# EAGLE design bpod_stepper_1.2 (EAGLE 9.6.2)
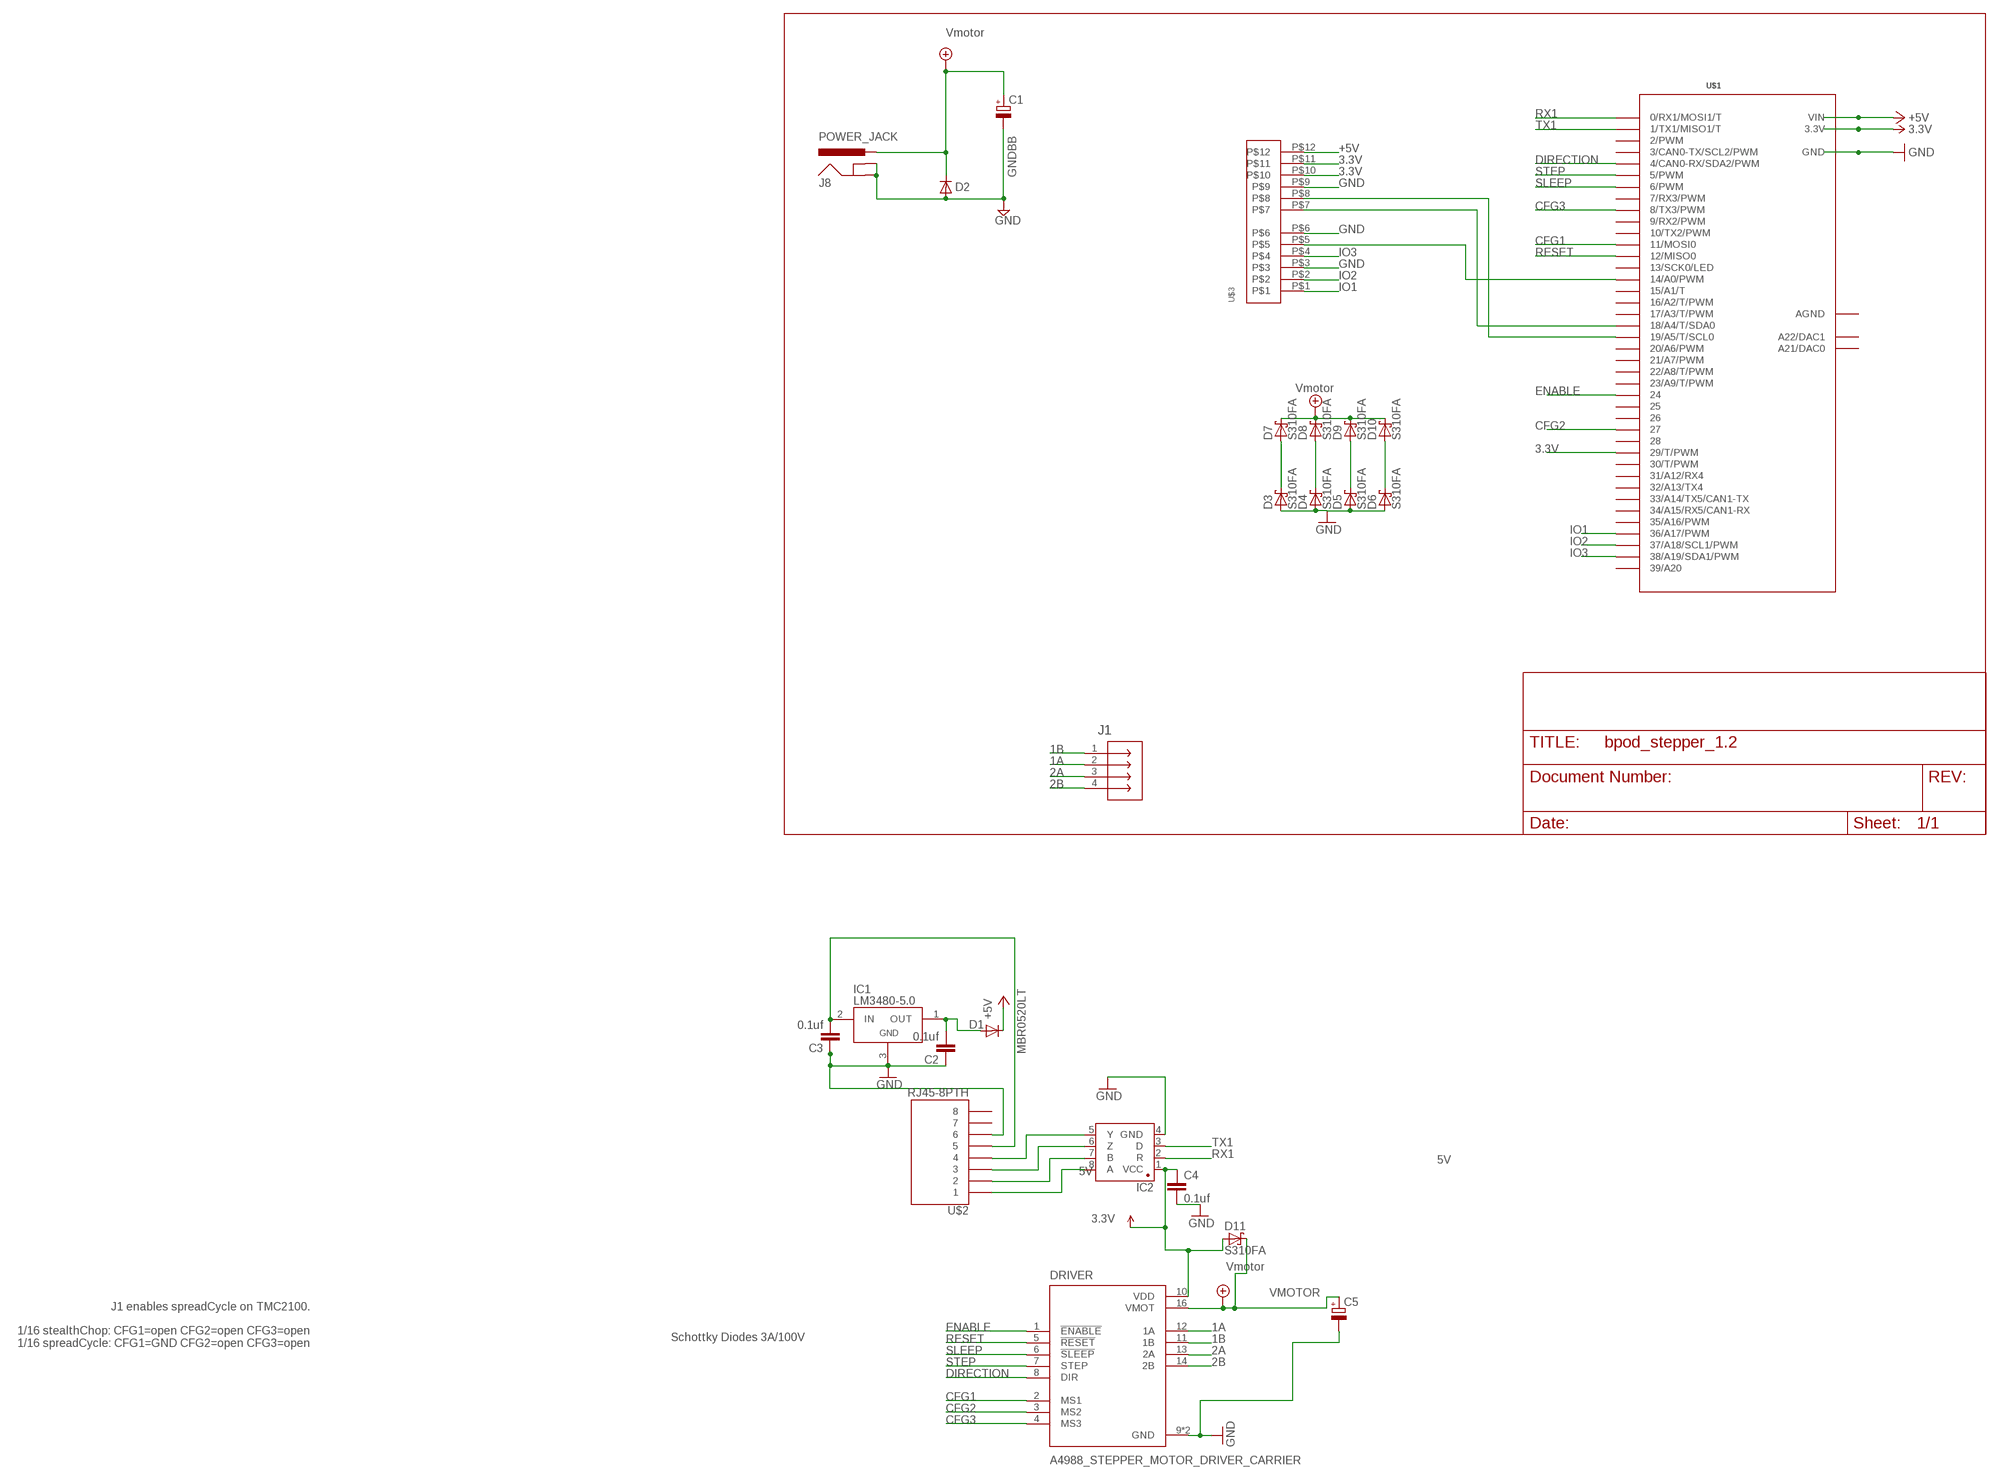
[diagram p0: schematic, sheet 1]

## Parts
C1  CPOL-EUG  [PANASONIC_G]
C2  0.1uf  CAP1206  [1206@1]
C3  0.1uf  CAP1206  [1206@1]
C4  0.1uf  CAP1206  [1206@1]
C5  CPOL-EUG  [PANASONIC_G]
D1  MBR0520LT  [SOD123]
D2  DIODE-DO214AA  [DO214AA]
D3  S310FA  D_SCHOTTKY-SOD123  [SOD123]
D4  S310FA  D_SCHOTTKY-SOD123  [SOD123]
D5  S310FA  D_SCHOTTKY-SOD123  [SOD123]
D6  S310FA  D_SCHOTTKY-SOD123  [SOD123]
D7  S310FA  D_SCHOTTKY-SOD123  [SOD123]
D8  S310FA  D_SCHOTTKY-SOD123  [SOD123]
D9  S310FA  D_SCHOTTKY-SOD123  [SOD123]
D10  S310FA  D_SCHOTTKY-SOD123  [SOD123]
D11  S310FA  D_SCHOTTKY-SOD123  [SOD123]
DRIVER  A4988_STEPPER_MOTOR_DRIVER_CARRIER  [MODULE_A4988_STEPPER_MOTOR_DRIVER_CARRIER]
IC1  LM3480-5.0  [SOT-23-3]
IC2  SN65HVD31DR  [SO08]
J1  282841-4  [CONN4_282841-4_TEC]
J8  POWER_JACK  [POWER_JACK_PTH]
U$1  TEENSY_3.6_DIL  [TEENSY_3.6_DIL]
U$2  RJ45-8PTH  [RJ45-8]
U$3  12POS_MOLEX_SOCKET  [12POS_MOLEX_SOCKET]

## Nets
1A: D4.C D8.A DRIVER.12(1A) J1.2
1B: D3.C D7.A DRIVER.11(1B) J1.1
2A: D5.C D9.A DRIVER.13(2A) J1.3
2B: D6.C D10.A DRIVER.14(2B) J1.4
3.3V: C4.1 D11.A DRIVER.10(VDD) IC2.1(VCC) U$1.3.3V U$1.3.3V3(3.3V) U$1.29(29/T/PWM) U$3.P$10 U$3.P$11
+5V: D1.C U$1.VIN U$3.P$12
CFG1: DRIVER.2(MS1) U$1.11(11/MOSI0)
CFG2: DRIVER.3(MS2) U$1.27
CFG3: DRIVER.4(MS3) U$1.8(8/TX3/PWM)
DIRECTION: DRIVER.8(DIR) U$1.4(4/CAN0-RX/SDA2/PWM)
ENABLE: DRIVER.1(!ENABLE) U$1.24
GND: C1.- C2.1 C3.1 C4.2 C5.- D2.A D3.A D4.A D5.A D6.A DRIVER.9(GND) DRIVER.15(GND) IC1.3(GND) IC2.4(GND) J8.GND J8.GNDBREAK U$1.GND U$1.GND1(GND) U$2.6 U$3.P$3 U$3.P$6 U$3.P$9
IO1: U$1.36/A17(36/A17/PWM) U$3.P$1
IO2: U$1.37/A18(37/A18/SCL1/PWM) U$3.P$2
IO3: U$1.38/A19(38/A19/SDA1/PWM) U$3.P$4
N$1: U$1.19/A5(19/A5/T/SCL0) U$3.P$8
N$2: U$1.18/A4(18/A4/T/SDA0) U$3.P$7
N$3: U$1.14/A0(14/A0/PWM) U$3.P$5
N$7: IC2.8(A) U$2.1
N$8: IC2.7(B) U$2.2
N$9: IC2.6(Z) U$2.3
N$10: IC2.5(Y) U$2.4
N$14: C2.2 D1.A IC1.1(OUT)
N$24: C3.2 IC1.2(IN) U$2.5
RESET: DRIVER.5(!RESET) U$1.12(12/MISO0)
RX1: IC2.2(R) U$1.0(0/RX1/MOSI1/T)
SLEEP: DRIVER.6(!SLEEP) U$1.6(6/PWM)
STEP: DRIVER.7(STEP) U$1.5(5/PWM)
TX1: IC2.3(D) U$1.1(1/TX1/MISO1/T)
VMOTOR: C1.+ C5.+ D2.C D7.C D8.C D9.C D10.C D11.C DRIVER.16(VMOT) J8.PWR ; supply symbol labelled Vmotor
Unconnected: U$1.2(2/PWM) U$1.3(3/CAN0-TX/SCL2/PWM) U$1.7(7/RX3/PWM) U$1.9(9/RX2/PWM) U$1.10(10/TX2/PWM) U$1.13(13/SCK0/LED) U$1.15/A1(15/A1/T) U$1.16/A2(16/A2/T/PWM) U$1.17/A3(17/A3/T/PWM) U$1.20/A6(20/A6/PWM) U$1.21/A7(21/A7/PWM) U$1.22/A8(22/A8/T/PWM) U$1.23/A9(23/A9/T/PWM) U$1.25 U$1.26 U$1.28 U$1.30(30/T/PWM) U$1.31/A12(31/A12/RX4) U$1.32/A13(32/A13/TX4) U$1.33/A14(33/A14/TX5/CAN1-TX) U$1.34/A15(34/A15/RX5/CAN1-RX) U$1.35/A16(35/A16/PWM) U$1.39/A20 U$1.A21(A21/DAC0) U$1.A22(A22/DAC1) U$2.7 U$2.8

## Notes on the sheet
- GNDBB
- 5V
- 5V
- J1 enables spreadCycle on TMC2100.
  
  1/16 stealthChop: CFG1=open CFG2=open CFG3=open
  1/16 spreadCycle: CFG1=GND CFG2=open CFG3=open
- Schottky Diodes 3A/100V

## Power pins joined to a net without a drawn wire
AGND: U$1.AGND

## Library data of the parts
C1 C5 = rcl:CPOL-EU: POLARIZED CAPACITOR, European symbol; SPICEPREFIX: C
C2-C4 = SparkFun-Capacitors:CAP: Capacitor Standard 0603 ceramic capacitor, and 0.1" leaded capacitor.
D1 = diode:MBR0520LT: SCHOTTKY BARRIER RECTIFIER Source: http://onsemi.com .. MBR0520LT1-D.pdf
D2 = diode:DIODE-: DIODE
D3-D11 = we-rcl:D_SCHOTTKY: Schottky Diodes 1A, 30V - SOD323 (BAS3010 or CUS10S40) 2A, 30V - SMA/DO214AC 10A,45V - Z5-T (CDBZ5T1045)
DRIVER = A4988_STEPPER_MOTOR_DRIVER_CARRIER:A4988_STEPPER_MOTOR_DRIVER_CARRIER: Stepper motor controler; IC: A4988; 1A; Uin mot: 8÷35V; AVAILABILITY: Unavailable; DESCRIPTION: Stepper Motor Driver; MF: Pololu; MP: A4988 STEPPER MOTOR DRIVER CARRIER; PACKAGE: None; PRICE: None
IC1 = regulators:LM3480-*: National Semiconductor LM3480 100 mA, SOT-23, quasi-LDO linear regulator
IC2 = Joshparts4:SN65HVD31DR: A placeholder for generic narrow & wide SOIC8 foorptints - used on the DIP adapter board.
J1 = TERMI-BLOK PCB MOUNT 4P. 5:282841-4; BUILT_BY: SunStream; COPYRIGHT: Copyright (C) 2018 Accelerated Designs. All rights reserved; DATASHEET: https://www.te.com/commerce/DocumentDelivery/DDEController?Action=showdoc&DocId=Customer+Drawing%7F282841%7FH6%7Fpdf%7FEnglish%7FENG_CD_282841_H6.pdf%7F282841-4; DESCRIPTION: TERMINAL BLOCK, PCB MOUNT, W/INTERLOCK, 5.08MM PITCH; MANUFACTURER_PART_NUMBER: 282841-4; SOURCELIBRARY: TE_Connectivity_600_Part_Delivery_14_2020-03-09; VENDOR: TE Connectivity
J8 = SparkFun-Connectors:POWER_JACK: Power Jack Connector This is the standard 5.5mm barrel jack for power. The PTH is the most common, proven, reliable, footprint. The Slot footprint only works if the mill layer is transmitted to the PCB fab house so be warned. Here are the connectors we sell at SparkFun: DC Barrel Power Jack/Connector <https://www.sparkfun.com/products/119> (PRT-00119) DC Barrel Power Jack/Connector (SMD) <https://www.sparkfun.com/products/12748> (PRT-12748) DC Barrel Jack Adapter - Breadboard Compatible <https://www.sparkfun.com/products/10811> (PRT-10811) It is used on this SparkFun product (and many, many others): SparkFun RedBoard - Programmed with Arduino <https://www.sparkfun.com/products/12757> (DEV-12757) Also, if you need a mating power supply or connector, please check these out: Wall Adapter Power Supply - 9VDC 650mA <https://www.sparkfun.com/products/298> (TOL-00298) DC Barrel Jack Adapter - Male <https://www.sparkfun.com/products/10287> (PRT-10287); PROD_ID: CONN-08197
U$1 = Teensy_3_and_LC_Series_Boards_v1.4:TEENSY_3.6_DIL: Teensy 3.6 DIL Package
U$2 = SparkFun:RJ45-8: RJ45 Jack Simple RJ45, 8-pin connection - connector for common Cat5, Cat5e, and Cat6 Ethernet cables. Footprint not yet proven in production. Connector sku is PRT-00643; Breakout PCB sku is BOB-00716.
U$3 = JoshParts10:12POS_MOLEX_SOCKET

## Board
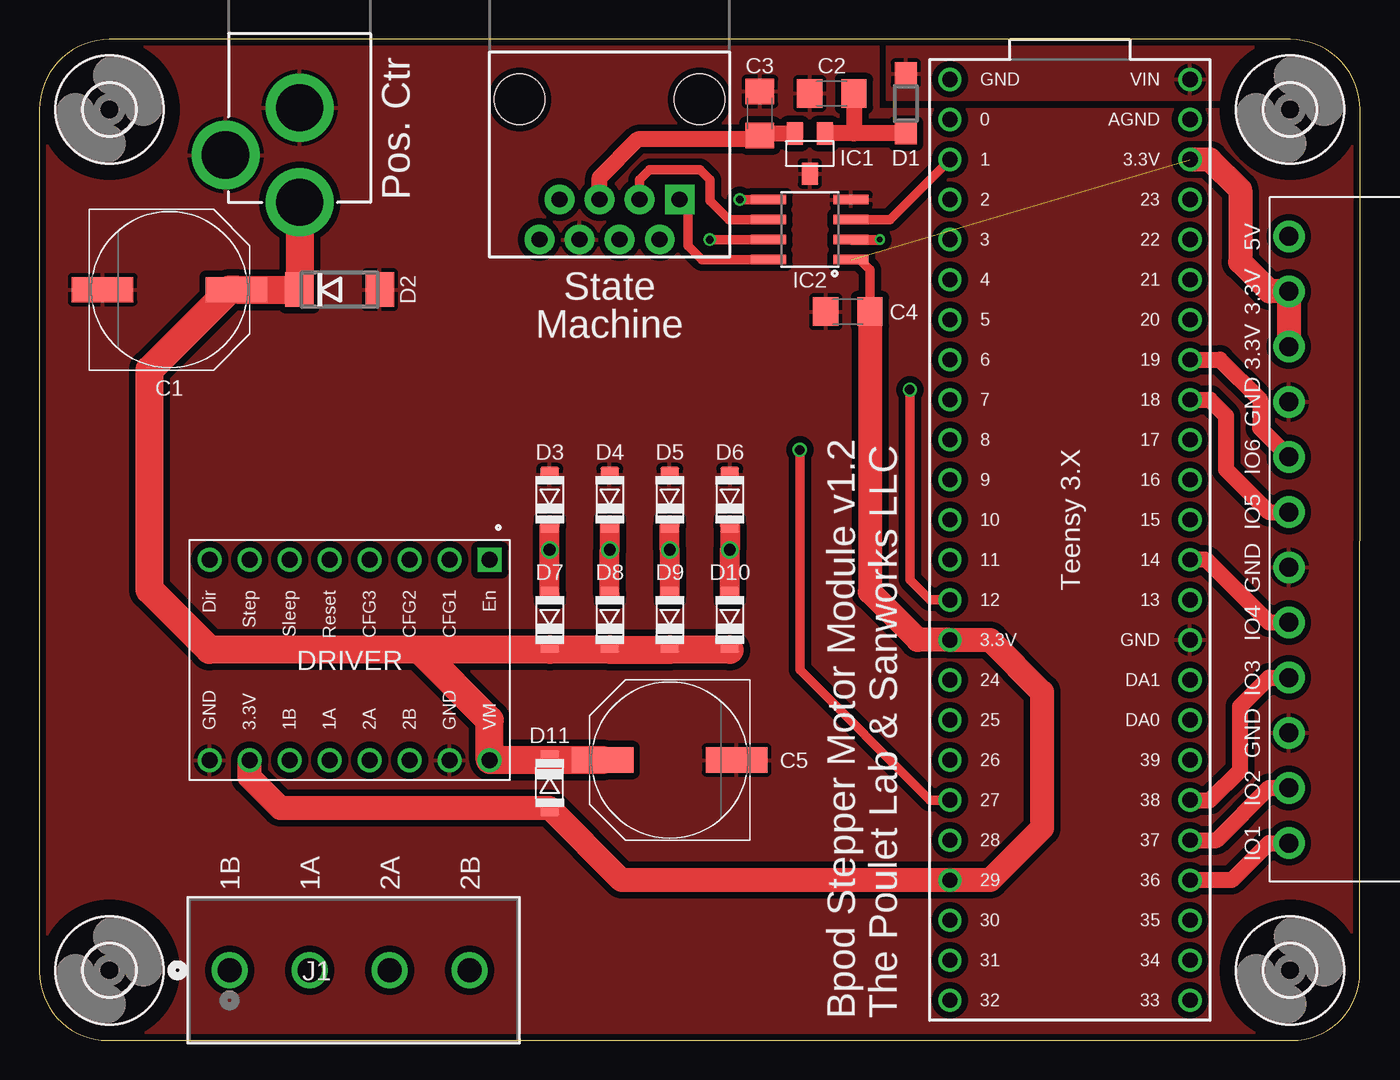
[diagram p1: board, top side]
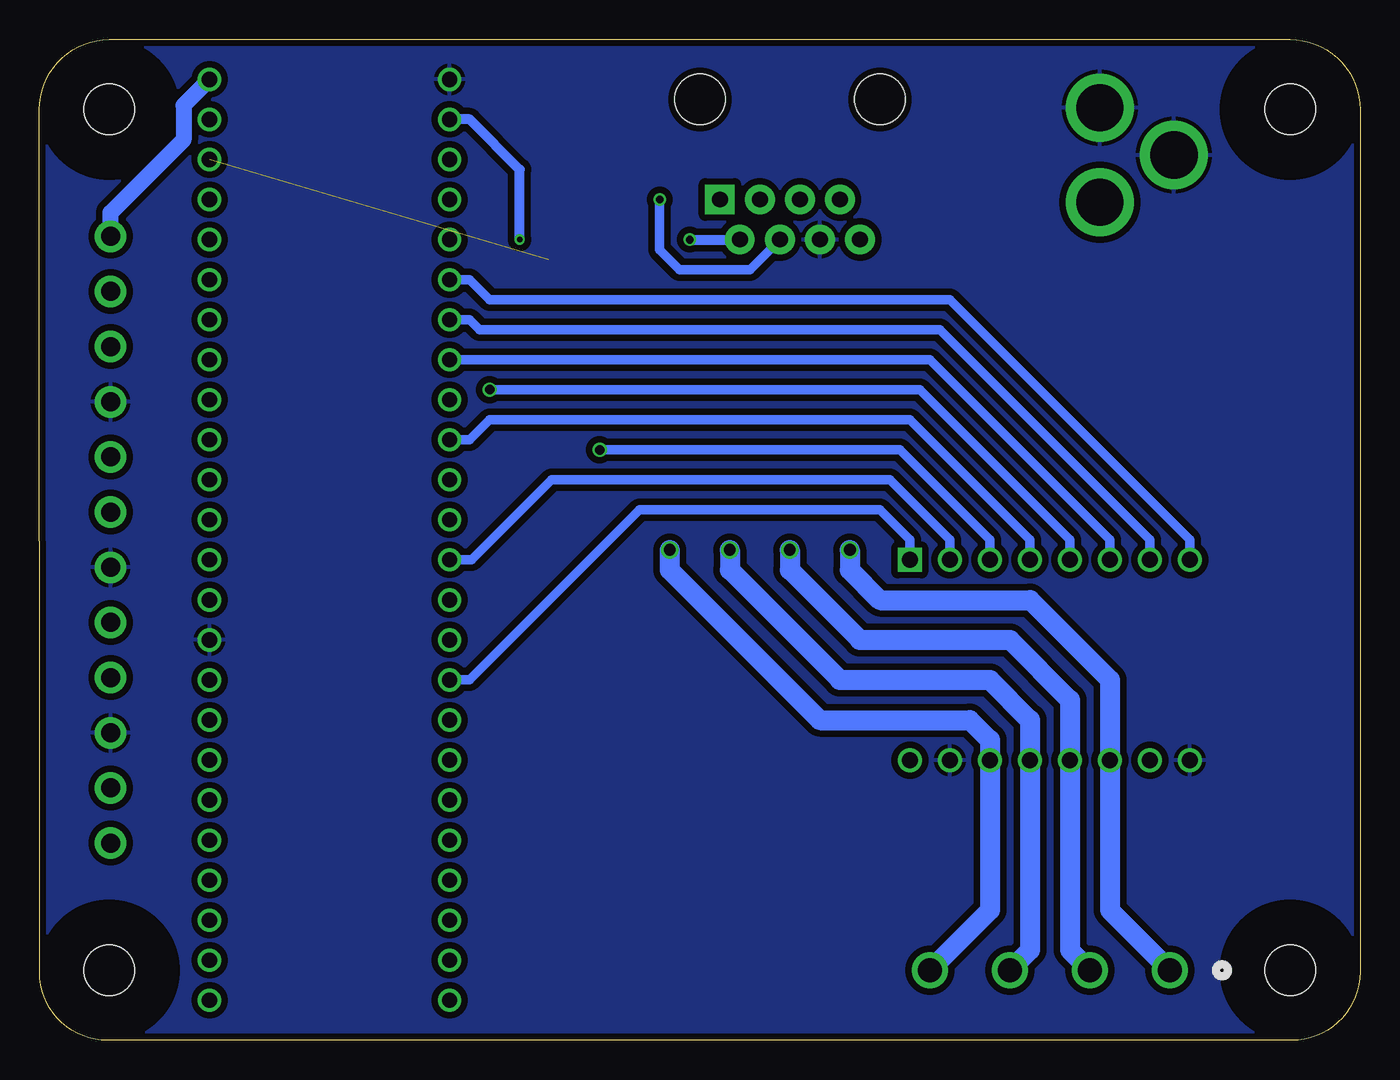
[diagram p2: board, bottom side, seen from below]

Size 83.82 x 63.5 mm. Coordinates in mm from the lower left corner, seen from the top.
Outline: 79.38,63.5 4.45,63.5 arc90 0,59.05 0,4.34 arc90 4.34,0 79.5,0 arc90 83.8,4.3 83.82,59.05 arc90 79.38,63.5
Copper layers (1*16): Top 0.035mm / dielectric 1.5mm / Bottom 0.035mm
Design rules "SeeedStudio_2layer_DRU_no_angle_20140221 *": minimum track width 6mil, minimum drill 12mil, track to track 12mil, track to pad 12mil, pad to pad 12mil, via to via 12mil, smd to smd 0mil, copper to edge 10mil, drill to drill 10mil, minimum pad ring 10mil, minimum via ring 6mil, stop-mask expansion 2mil, vias tented up to drill 100mil, thermal gap 10mil

### Footprints (pad centres in the part's own frame; a part is rotated, then mirrored left to right if it is on the bottom)
PANASONIC_G = smd 3.9 x 1.6: + 4.25,0; - -4.25,0
1206@1 = smd 1.6 x 1.8: 1 -1.4,0; 2 1.4,0
SOD123 = smd 1.4 x 1.4: A 1.9,0; C -1.9,0
DO214AA = smd 1.8 x 2.2: A 2.55,0; C -2.55,0
SOD123' = smd 1.2 x 1: A 0,-1.6; C 0,1.6
MODULE_A4988_STEPPER_MOTOR_DRIVER_CARRIER = drill 1.02 square: 1 -6.35,8.89 | drill 1.02: 2 -6.35,6.35; 3 -6.35,3.81; 4 -6.35,1.27; 5 -6.35,-1.27; 6 -6.35,-3.81; 7 -6.35,-6.35; 8 -6.35,-8.89; 9 6.35,-8.89; 10 6.35,-6.35; 11 6.35,-3.81; 12 6.35,-1.27; 13 6.35,1.27; 14 6.35,3.81; 15 6.35,6.35; 16 6.35,8.89
SOT-23-3 = smd 1.016 x 1.397: 1 -0.953,-1.27; 2 0.953,-1.27; 3 0,1.27
SO08 = smd 0.61 x 2.21: 1 -1.905,-2.616; 2 -0.635,-2.616; 3 0.635,-2.616; 4 1.905,-2.616; 5 1.905,2.616; 6 0.635,2.616; 7 -0.635,2.616; 8 -1.905,2.616
CONN4_282841-4_TEC = drill 1.524 pad 2.032: 1 0,0; 2 5.08,0; 3 10.16,0; 4 15.24,0
POWER_JACK_PTH = drill 2.997 pad 4.318: GND 0,7.7; GNDBREAK 4.7,10.7; PWR 0,13.7
TEENSY_3.6_DIL = drill 0.965: 0 -7.62,25.4; 1 -7.62,22.86; 2 -7.62,20.32; 3 -7.62,17.78; 3.3V 7.62,22.86; 3.3V3 -7.62,-7.62; 4 -7.62,15.24; 5 -7.62,12.7; 6 -7.62,10.16; 7 -7.62,7.62; 8 -7.62,5.08; 9 -7.62,2.54; 10 -7.62,0; 11 -7.62,-2.54; 12 -7.62,-5.08; 13 7.62,-5.08; 14/A0 7.62,-2.54; 15/A1 7.62,0; 16/A2 7.62,2.54; 17/A3 7.62,5.08; 18/A4 7.62,7.62; 19/A5 7.62,10.16; 20/A6 7.62,12.7; 21/A7 7.62,15.24; 22/A8 7.62,17.78; 23/A9 7.62,20.32; 24 -7.62,-10.16; 25 -7.62,-12.7; 26 -7.62,-15.24; 27 -7.62,-17.78; 28 -7.62,-20.32; 29 -7.62,-22.86; 30 -7.62,-25.4; 31/A12 -7.62,-27.94; 32/A13 -7.62,-30.48; 33/A14 7.62,-30.48; 34/A15 7.62,-27.94; 35/A16 7.62,-25.4; 36/A17 7.62,-22.86; 37/A18 7.62,-20.32; 38/A19 7.62,-17.78; 39/A20 7.62,-15.24; A21 7.62,-12.7; A22 7.62,-10.16; AGND 7.62,25.4; GND -7.62,27.94; GND1 7.62,-7.62; VIN 7.62,27.94
RJ45-8 = drill 1 pad 1.88 square: 1 -4.445,6.35 | drill 1 pad 1.88: 2 -3.175,8.89; 3 -1.905,6.35; 4 -0.635,8.89; 5 0.635,6.35; 6 1.905,8.89; 7 3.175,6.35; 8 4.445,8.89 | hole 3.2: -5.715,0; 5.715,0
12POS_MOLEX_SOCKET = drill 1.2 pad 2: P$1 -19.239,0.706; P$2 -15.739,0.706; P$3 -12.239,0.706; P$4 -8.739,0.706; P$5 -5.239,0.706; P$6 -1.739,0.706; P$7 1.761,0.706; P$8 5.261,0.706; P$9 8.761,0.706; P$10 12.261,0.706; P$11 15.761,0.706; P$12 19.261,0.706
3,2 = hole 3.2: 0,0

### Placement (x,y rotation side)
C1  8.26,47.62 0 top
C2  50.29,60.07 0 top
C3  45.72,58.8 270 top
C4  51.31,46.23 180 top
C5  40.01,17.78 180 top
D1  54.99,59.44 270 top
D2  19.05,47.62 0 top
D3  S310FA  [SOD123']  32.38,34.29 180 top
D4  S310FA  [SOD123']  36.2,34.29 180 top
D5  S310FA  [SOD123']  40.01,34.29 180 top
D6  S310FA  [SOD123']  43.81,34.29 180 top
D7  S310FA  [SOD123']  32.38,26.67 180 top
D8  S310FA  [SOD123']  36.2,26.67 180 top
D9  S310FA  [SOD123']  40.01,26.67 180 top
D10  S310FA  [SOD123']  43.81,26.67 180 top
D11  S310FA  [SOD123']  32.38,16.32 0 top
DRIVER  19.68,24.13 270 top
IC1  48.9,56.26 180 top
IC2  48.9,51.44 90 top
J1  12.06,4.45 0 top
J8  16.51,66.87 180 top
U$1  65.41,33.02 0 top
U$2  36.19,59.69 180 top
U$3  80,31.75 90 top
U$7  [3,2]  4.45,4.45 0 top
U$8  [3,2]  4.45,59.05 0 top
U$9  [3,2]  79.38,59.05 0 top
U$10  [3,2]  79.38,4.45 0 top

### Tracks (layer width: path | path; a pad name or v marks a point on that pad's centre or on a via)
1A  (via drill 0.75)
  Top 1.27: D8.A v36.2,31.11 D4.C
  Bottom 1.27: v36.2,31.11 36.2,29.84 31.75,25.4 22.23,25.4 18.41,21.59 DRIVER.12 18.41,5.71 J1.2
1B  (via drill 0.75)
  Top 0.61: D3.C v32.38,31.11
  Top 1.27: D7.A D3.C
  Bottom 1.27: v32.38,31.11 32.38,29.84 30.46,27.92 20.94,27.92 15.88,22.86 DRIVER.11 15.88,8.26 J1.1
2A  (via drill 0.75)
  Top 1.27: D5.C v40.01,31.11 D9.A
  Bottom 1.27: v40.01,31.11 40.01,29.84 33.02,22.86 23.5,22.86 20.95,20.32 DRIVER.13 20.95,5.71 J1.3
2B  (via drill 0.75)
  Top 1.27: D6.C v43.81,31.11 D10.A
  Bottom 1.27: v43.81,31.11 43.81,29.84 34.29,20.32 24.77,20.32 23.5,19.05 DRIVER.14 23.5,8.26 J1.4
3.3V  (1 unrouted)
  Top 0.61: C4.1 52.71,48.9 52.07,49.53 IC2.1
  Top 1.524: DRIVER.10 13.34,16.7 15.3,14.73 32.37,14.73 D11.A 32.4,14.72 36.96,10.16 U$1.29 60.33,10.16 63.63,13.46 63.63,22.1 60.33,25.4 U$1.3.3V3 55.75,25.4 52.71,28.45 C4.1 | U$1.3.3V 74.3,55.88 76.2,53.98 76.2,49.38 78.07,47.51 U$3.P$11 U$3.P$10
+5V
  Bottom 1.016: U$3.P$12 79.29,52.51 74.68,57.13 74.68,59.31 U$1.VIN
  pour Top (isolate 0.406): 83.82,63.5 83.82,59.69 53.85,59.69 53.85,63.5
CFG1
  Bottom 0.61: DRIVER.2 26.04,31.75 29.84,35.56 51.31,35.56 56.39,30.48 U$1.11
CFG2  (via drill 0.6)
  Top 0.61: U$1.27 56.52,15.24 48.26,23.5 v48.26,37.47
  Bottom 0.61: v48.26,37.47 29.21,37.47 23.5,31.75 DRIVER.3
CFG3
  Bottom 0.61: DRIVER.4 20.95,31.75 28.57,39.37 55.24,39.37 56.52,38.1 U$1.8
DIRECTION
  Bottom 0.61: DRIVER.8 10.79,31.75 26.04,46.99 55.24,46.99 56.52,48.26 U$1.4
ENABLE
  Bottom 0.61: U$1.24 56.52,22.86 45.72,33.66 30.48,33.66 28.57,31.75 DRIVER.1
GND
  pour Bottom (isolate 0.406): 83.82,63.5 0,63.5 0,0 83.82,0
  pour Top (isolate 0.406): 83.82,0 0,0 0,63.5 53.21,63.5 53.21,59.05 83.82,59.05
IO1
  Top 1.016: U$3.P$1 78.02,12.51 75.67,10.16 U$1.36/A17
IO2
  Top 1.016: U$1.37/A18 74.71,12.7 78.02,16.01 U$3.P$2
IO3
  Top 1.016: U$1.38/A19 74.3,15.24 76.2,17.14 76.2,21.19 78.02,23.01 U$3.P$4
N$1
  Top 1.016: U$1.19/A5 74.93,43.18 77.47,40.64 77.47,38.84 U$3.P$8
N$2
  Top 1.016: U$1.18/A4 74.3,40.64 75.31,39.62 75.31,36.22 78.02,33.51 U$3.P$7
N$3
  Top 1.016: U$3.P$5 78.02,26.51 74.06,30.48 U$1.14/A0
N$7
  Top 0.61: IC2.8 42.04,49.53 41.15,50.42 41.15,53.34 U$2.1
N$8  (via drill 0.5)
  Top 0.61: v42.55,50.8 IC2.7
  Bottom 0.635: v42.55,50.8 U$2.2
N$9
  Top 0.61: IC2.6 43.75,52.07 42.55,53.28 42.55,54.61 41.91,55.24 38.73,55.24 38.09,54.6 U$2.3
N$10  (via drill 0.5)
  Top 0.61: IC2.5 v44.45,53.34
  Bottom 0.61: v44.45,53.34 44.45,50.16 43.18,48.9 38.73,48.9 U$2.4
N$14
  Top 1.016: D1.A 51.69,57.53 | 51.69,57.53 IC1.1 | C2.2 51.69,57.53
N$24
  Top 0.61: 45.85,57.15 45.85,57.27 C3.2 45.72,57.53
  Top 1.016: U$2.5 35.55,54.74 37.96,57.15 45.85,57.15 | 45.72,57.53 IC1.2
RESET  (via drill 0.6)
  Top 0.61: U$1.12 56.52,27.94 55.24,29.21 v55.24,41.27
  Bottom 0.61: v55.24,41.27 27.94,41.27 18.41,31.75 DRIVER.5
RX1  (via drill 0.35)
  Top 0.635: IC2.2 v53.34,50.8
  Bottom 0.635: v53.34,50.8 53.34,55.24 56.52,58.42 U$1.0
SLEEP
  Bottom 0.61: DRIVER.6 15.88,31.75 27.3,43.18 U$1.6
STEP
  Bottom 0.61: DRIVER.7 13.34,31.75 26.67,45.09 55.88,45.09 56.52,45.72 U$1.5
TX1
  Top 0.61: IC2.3 53.98,52.07 U$1.1
VMOTOR
  Top 0.254: D11.C 32.38,17.78
  Top 1.27: D7.C 32.38,24.77 | 43.81,24.77 D10.C | D8.C 36.2,24.77 | 40.01,24.77 D9.C
  Top 1.778: 24.13,24.77 32.38,24.77 36.2,24.77 40.01,24.77 43.81,24.77 | 24.13,24.77 10.79,24.77 6.99,28.57 6.99,42.55 12.06,47.62 C1.+ D2.C 16.51,47.63 J8.PWR | C5.+ 32.38,17.78 DRIVER.16 28.57,20.32 24.13,24.77

### Text on the board
tPlace: Pos. Ctr | State | Machine
tNames: GND | VIN | 0 | AGND | 1 | 3.3V | 2 | 23 | 3 | 22 | 5V | 4 | 21 | 3.3V | 5 | 20 | 3.3V | 6 | 19 | 7 | 18 | GND | 8 | 17 | IO6 | 9 | 16 | IO5 | 10 | Teensy 3.X | 15 | 11 | 14 | GND | Dir | Step | Sleep | Reset | CFG3 | CFG2 | CFG1 | En | 12 | 13 | IO4 | 3.3V | GND | 24 | DA1 | IO3 | GND | 3.3V | 1B | 1A | 2A | 2B | GND | VM | 25 | DA0 | GND | 26 | 39 | IO2 | 27 | 38 | 28 | 37 | IO1 | 1B | 1A | 2A | 2B | 29 | 36 | 30 | 35 | 31 | 34 | 32 | 33 | Bpod Stepper Motor Module v1.2 / The Poulet Lab & Sanworks LLC